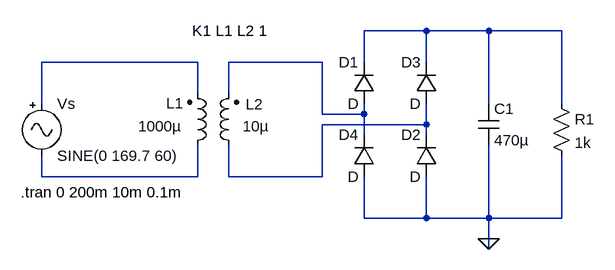
[diagram p0: schematic Full_Wave_Rectifier.asc]
Full_Wave_Rectifier.asc, the LTspice schematic file:
Version 4
SHEET 1 880 680
WIRE 480 -48 384 -48
WIRE 576 -48 480 -48
WIRE 688 -48 576 -48
WIRE 128 0 -112 0
WIRE 320 0 176 0
WIRE 384 0 384 -48
WIRE 480 0 480 -48
WIRE 128 48 128 0
WIRE 176 48 176 0
WIRE -112 64 -112 0
WIRE 576 64 576 -48
WIRE 688 64 688 -48
WIRE 320 80 320 0
WIRE 384 80 384 64
WIRE 384 80 320 80
WIRE 480 96 480 64
WIRE 480 96 320 96
WIRE 384 112 384 80
WIRE 480 112 480 96
WIRE -112 176 -112 144
WIRE 128 176 128 128
WIRE 128 176 -112 176
WIRE 176 176 176 128
WIRE 320 176 320 96
WIRE 320 176 176 176
WIRE 384 240 384 176
WIRE 480 240 480 176
WIRE 480 240 384 240
WIRE 576 240 576 128
WIRE 576 240 480 240
WIRE 688 240 688 144
WIRE 688 240 576 240
WIRE 576 272 576 240
WIRE 576 288 576 272
FLAG 576 272 0
SYMBOL ind2 112 144 M180
WINDOW 0 -32 81 Left 2
WINDOW 3 -75 45 Left 2
SYMATTR InstName L1
SYMATTR Value 1000µ
SYMATTR SpiceLine Rser=0.01
SYMBOL ind2 192 144 R180
WINDOW 0 -37 79 Left 2
WINDOW 3 -46 45 Left 2
SYMATTR InstName L2
SYMATTR Value 10µ
SYMBOL Misc\\signal -112 48 R0
WINDOW 123 0 0 Left 0
WINDOW 39 0 0 Left 0
SYMATTR InstName Vs
SYMATTR Value SINE(0 169.7 60)
SYMBOL res 672 48 R0
SYMATTR InstName R1
SYMATTR Value 1k
SYMBOL diode 496 176 R180
WINDOW 0 24 64 Left 2
WINDOW 3 24 0 Left 2
SYMATTR InstName D2
SYMBOL diode 496 64 R180
WINDOW 0 24 64 Left 2
WINDOW 3 24 0 Left 2
SYMATTR InstName D3
SYMBOL diode 400 176 R180
WINDOW 0 24 64 Left 2
WINDOW 3 24 0 Left 2
SYMATTR InstName D4
SYMBOL cap 560 64 R0
SYMATTR InstName C1
SYMATTR Value 470µ
SYMBOL diode 400 64 R180
WINDOW 0 24 64 Left 2
WINDOW 3 24 0 Left 2
SYMATTR InstName D1
TEXT 120 -48 Left 2 !K1 L1 L2 1
TEXT -144 200 Left 2 !.tran 0 200m 10m 0.1m

The netlist it stands for:
* Full_Wave_Rectifier.asc
L1 N005 N002 1000µ Rser=0.01
L2 N004 N003 10µ
Vs N002 N005 SINE(0 169.7 60)
R1 N001 0 1k
D2 0 N004 D
D3 N004 N001 D
D4 0 N003 D
C1 N001 0 470µ
D1 N003 N001 D
.model D D
.lib standard.dio
K1 L1 L2 1
.tran 0 200m 10m 0.1m
.backanno
.end